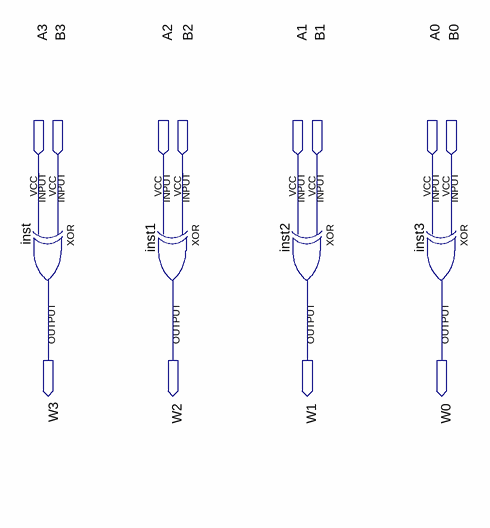
[diagram p0: schematic sheet]
// Quartus schematic 4BitXOR.bdf as structural Verilog: 4 symbols, 12 pins
module \4BitXOR  (
  input  A3,
  input  B3,
  input  A2,
  input  B2,
  input  A1,
  input  B1,
  input  A0,
  input  B0,
  output W3,
  output W2,
  output W1,
  output W0
);

  xor inst (W3, B3, A3);
  xor inst1 (W2, B2, A2);
  xor inst2 (W1, B1, A1);
  xor inst3 (W0, B0, A0);
endmodule
